# EAGLE design led board (EAGLE 9.6.2)
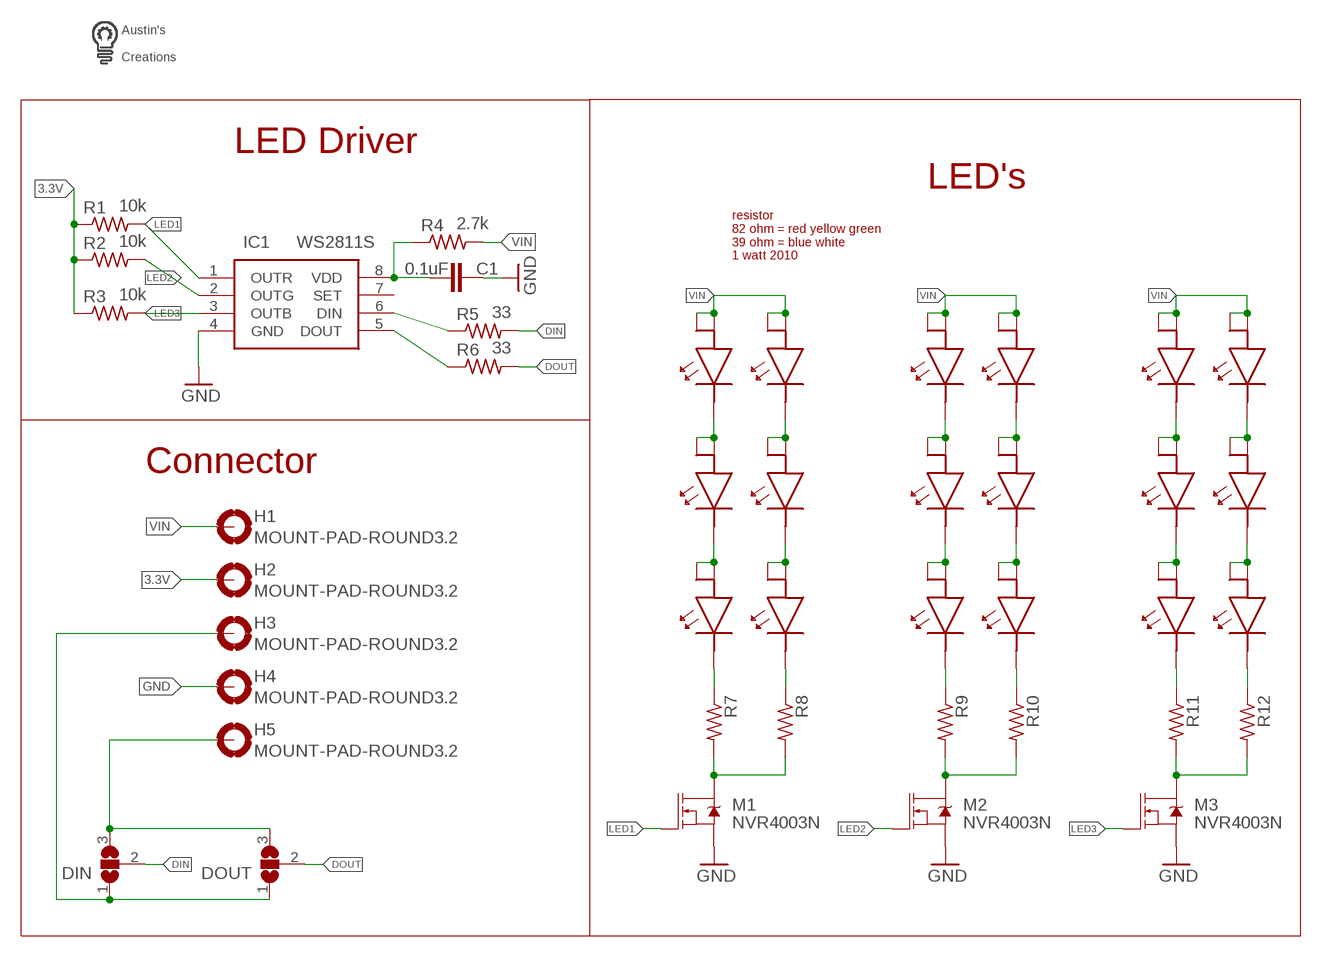
[diagram p0: schematic, sheet 1]

## Parts
C1  0.1uF  C-EUC0603K  [C0603K]
DIN  SJ2WW  [SJ_2W]
DOUT  SJ2WW  [SJ_2W]
H1  MOUNT-PAD-ROUND3.2  [3,2-PAD]
H2  MOUNT-PAD-ROUND3.2  [3,2-PAD]
H3  MOUNT-PAD-ROUND3.2  [3,2-PAD]
H4  MOUNT-PAD-ROUND3.2  [3,2-PAD]
H5  MOUNT-PAD-ROUND3.2  [3,2-PAD]
IC1  WS2811S  [SOIC127P600X175-8N]
L1  5730LED  [5730LED]
L2  5730LED  [5730LED]
L3  5730LED  [5730LED]
L4  5730LED  [5730LED]
L5  5730LED  [5730LED]
L6  5730LED  [5730LED]
L7  5730LED  [5730LED]
L8  5730LED  [5730LED]
L9  5730LED  [5730LED]
L10  5730LED  [5730LED]
L11  5730LED  [5730LED]
L12  5730LED  [5730LED]
L13  5730LED  [5730LED]
L14  5730LED  [5730LED]
L15  5730LED  [5730LED]
L16  5730LED  [5730LED]
L17  5730LED  [5730LED]
L18  5730LED  [5730LED]
M1  NVR4003N  [SOT23]
M2  NVR4003N  [SOT23]
M3  NVR4003N  [SOT23]
R1  10k  R-US_R0603  [R0603]
R2  10k  R-US_R0603  [R0603]
R3  10k  R-US_R0603  [R0603]
R4  2.7k  R-US_R0603  [R0603]
R5  33  R-US_R0603  [R0603]
R6  33  R-US_R0603  [R0603]
R7  R-US_R2010  [R2010]
R8  R-US_R2010  [R2010]
R9  R-US_R2010  [R2010]
R10  R-US_R2010  [R2010]
R11  R-US_R2010  [R2010]
R12  R-US_R2010  [R2010]
U$2  LOGO  [LOGO]

## Nets
3.3V: H2.B3,2(MOUNT) R1.1 R2.1 R3.1
DIN: DIN.2 R5.2
DOUT: DOUT.2 R6.2
GND: C1.1 H4.B3,2(MOUNT) IC1.4(GND) M1.3(S) M2.3(S) M3.3(S)
LED1: IC1.1(OUTR) M1.2(G) R1.2
LED2: IC1.2(OUTG) M2.2(G) R2.2
LED3: IC1.3(OUTB) M3.2(G) R3.2
N$1: DIN.3 DOUT.3 H5.B3,2(MOUNT)
N$2: DIN.1 DOUT.1 H3.B3,2(MOUNT)
N$3: L3.P$2 R7.1
N$4: C1.2 IC1.8(VDD) R4.1
N$5: IC1.6(DIN) R5.1
N$6: IC1.5(DOUT) R6.1
N$8: L2.P$2 L3.P$1 L3.P$3
N$9: L1.P$2 L2.P$1 L2.P$3
N$11: M1.1(D) R7.2 R8.2
N$12: L6.P$2 R8.1
N$13: L5.P$2 L6.P$1 L6.P$3
N$14: L4.P$2 L5.P$1 L5.P$3
N$16: L9.P$2 R9.1
N$17: L8.P$2 L9.P$1 L9.P$3
N$18: L7.P$2 L8.P$1 L8.P$3
N$20: M2.1(D) R9.2 R10.2
N$21: L12.P$2 R10.1
N$22: L11.P$2 L12.P$1 L12.P$3
N$23: L10.P$2 L11.P$1 L11.P$3
N$24: L15.P$2 R11.1
N$25: L14.P$2 L15.P$1 L15.P$3
N$26: L13.P$2 L14.P$1 L14.P$3
N$28: M3.1(D) R11.2 R12.2
N$29: L18.P$2 R12.1
N$30: L17.P$2 L18.P$1 L18.P$3
N$31: L16.P$2 L17.P$1 L17.P$3
VIN: H1.B3,2(MOUNT) L1.P$1 L1.P$3 L4.P$1 L4.P$3 L7.P$1 L7.P$3 L10.P$1 L10.P$3 L13.P$1 L13.P$3 L16.P$1 L16.P$3 R4.2
Unconnected: IC1.7(SET)

## Notes on the sheet
- LED Driver
- LED's
- resistor 
  82 ohm = red yellow green
  39 ohm = blue white
  1 watt 2010
- Connector

## Library data of the parts
C1 = rcl:C-EU: CAPACITOR, European symbol; SPICEPREFIX: C
DIN DOUT = jumper:SJ2W: SMD solder JUMPER
H1-H5 = holes:MOUNT-PAD-ROUND: MOUNTING PAD, round
IC1 = SamacSys_Parts:WS2811S: RGB led driver Source: Datasheet <https://cdn-shop.adafruit.com/datasheets/WS2811.pdf>; DESCRIPTION: RGB led driver; HEIGHT: 1.75mm; MANUFACTURER_NAME: Worldsemi; MANUFACTURER_PART_NUMBER: ws2811s
L1-L18 = custom parts:5730LED
M1-M3 = custom parts:NVR4003N
R1-R6 = resistor:R-US_: RESISTOR, American symbol
R7-R12 = rcl:R-US_: RESISTOR, American symbol; SPICEPREFIX: R
U$2 = custom parts:LOGO

## Board
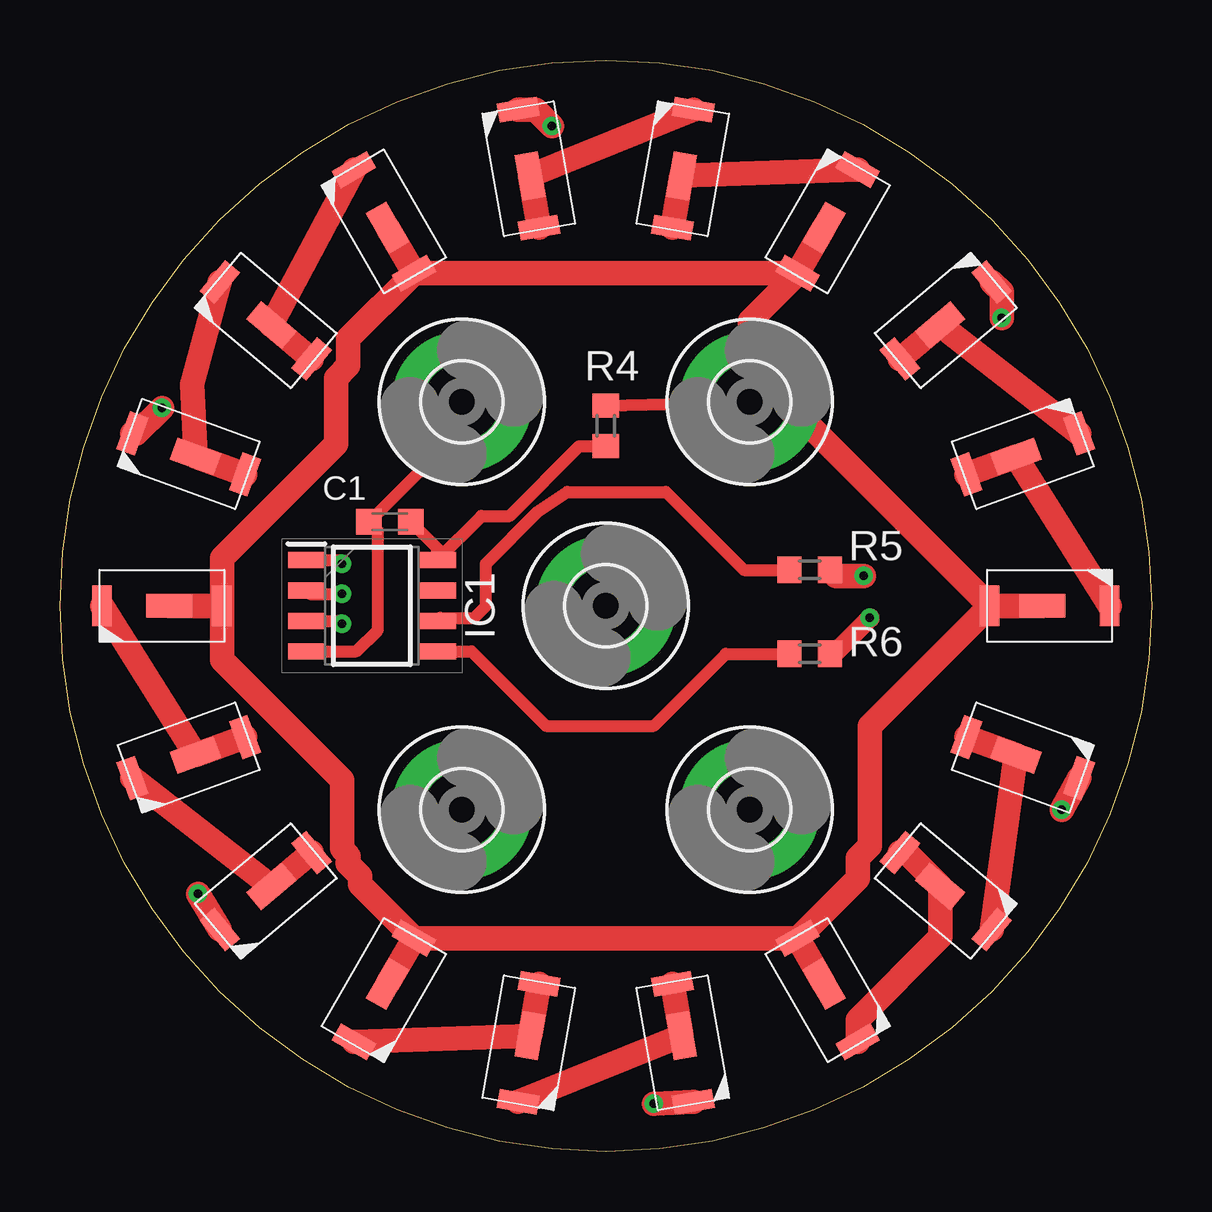
[diagram p1: board, top side]
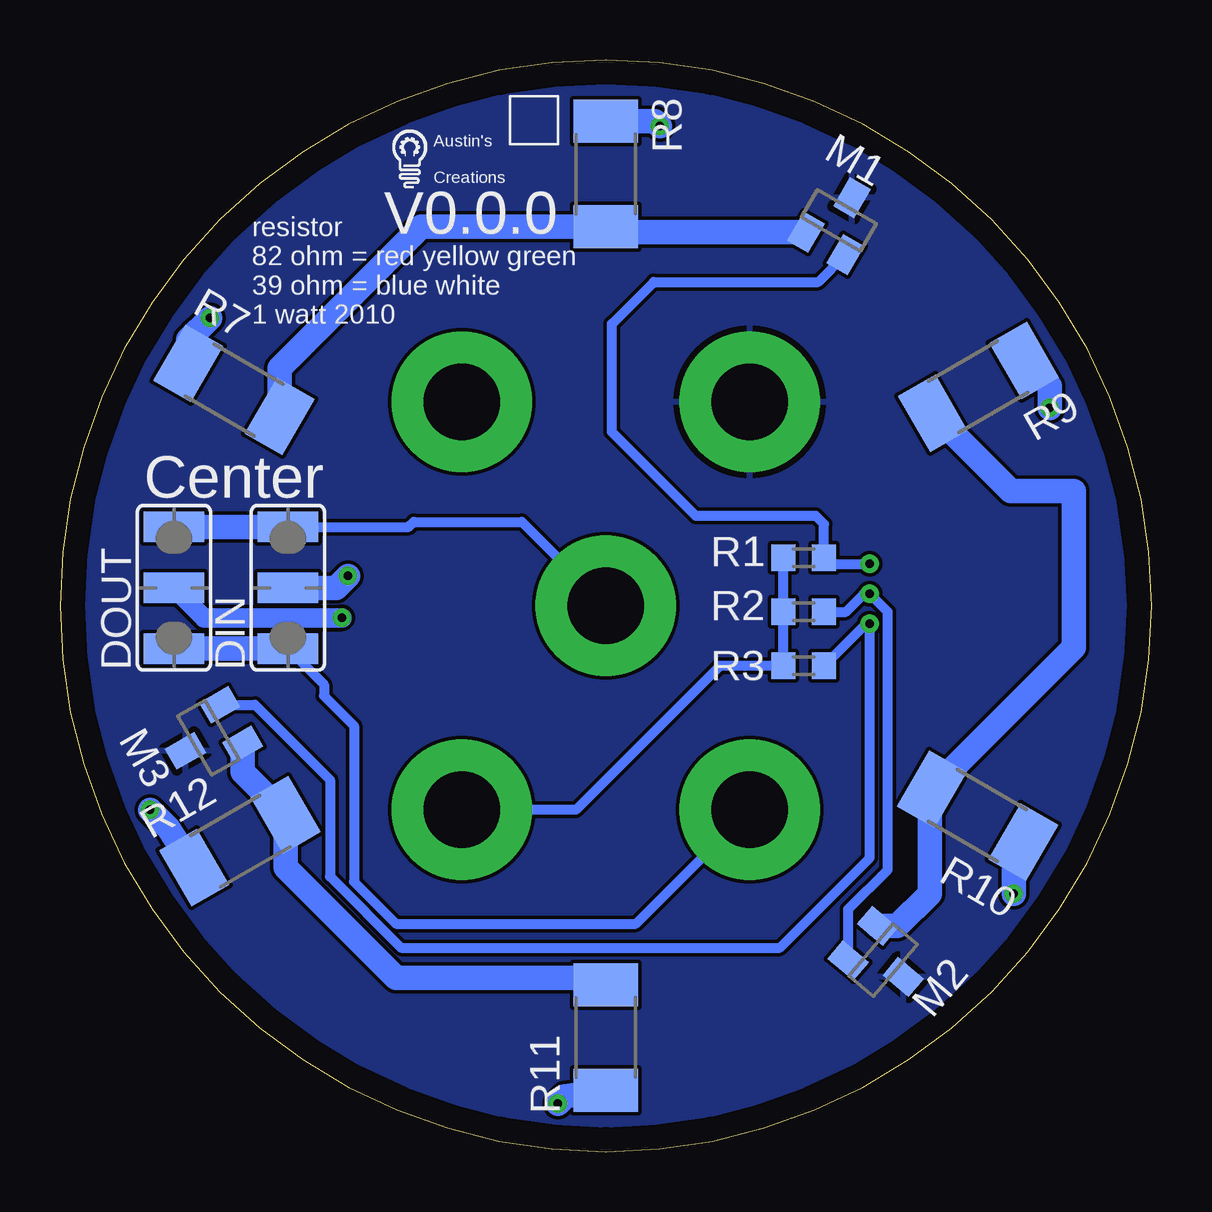
[diagram p2: board, bottom side, seen from below]

Size 45.5 x 45.5 mm. Coordinates in mm from the lower left corner, seen from the top.
Outline: 22.75,0 arc-180 22.75,45.5 arc-180 22.75,0
Copper layers (1*16): Top 0.035mm / dielectric 1.5mm / Bottom 0.035mm
Design rules "default *": minimum track width 10mil, minimum drill 0.35mm, track to track 6mil, track to pad 6mil, pad to pad 6mil, via to via 6mil, smd to smd 6mil, copper to edge 40mil, drill to drill 6mil, minimum pad ring 10mil, minimum via ring 8mil, stop-mask expansion 4mil, vias tented up to drill 0mil, thermal gap 10mil

### Footprints (pad centres in the part's own frame; a part is rotated, then mirrored left to right if it is on the bottom)
C0603K = smd 1.05 x 1.08: 1 -0.875,0; 2 0.875,0
SJ_2W = smd 1.27 x 2.54: 1 -2.54,0; 2 0,0; 3 2.54,0
3,2-PAD = drill 3.2 pad 5.842: B3,2 0,0
SOIC127P600X175-8N = smd 1.55 x 0.65: 1 -2.725,1.905; 2 -2.725,0.635; 3 -2.725,-0.635; 4 -2.725,-1.905; 5 2.725,-1.905; 6 2.725,-0.635; 7 2.725,0.635; 8 2.725,1.905
5730LED = smd 0.813 x 1.676: P$1 -2.5,0; P$2 2.5,0 | smd 1.93 x 0.965: P$3 -0.3,0
SOT23 = smd 1 x 1.4: 1 -0.95,-1.1; 2 0.95,-1.1; 3 0,1.1
R0603 = smd 1 x 1.1: 1 -0.85,0; 2 0.85,0
R2010 = smd 1.8 x 2.7: 1 -2.2,0; 2 2.2,0

### Placement (x,y rotation side)
C1  13.75,26.25 0 top
DIN  36,23.5 90 bottom
DOUT  40.75,23.5 90 bottom
H1  28.75,31.25 0 top
H2  28.75,14.25 0 top
H3  16.75,14.25 0 top
H4  16.75,31.25 0 top
H5  22.75,22.75 0 top
IC1  13,22.75 0 top
L1  41.25,22.75 0 top
L2  40.13,29.08 20 top
L3  36.92,34.64 40 top
L4  32,38.77 60 top
L5  25.96,40.97 80 top
L6  19.54,40.97 100 top
L7  13.5,38.77 120 top
L8  8.58,34.64 140 top
L9  5.37,29.08 160 top
L10  4.25,22.75 180 top
L11  5.37,16.42 200 top
L12  8.58,10.86 220 top
L13  13.5,6.73 240 top
L14  19.54,4.53 260 top
L15  25.96,4.53 280 top
L16  32,6.73 300 top
L17  36.92,10.86 320 top
L18  40.13,16.42 340 top
M1  13.03,38.81 330 bottom
M2  11.19,7.98 230 bottom
M3  39.32,17.25 120 bottom
R1  14.5,24.75 0 bottom
R2  14.5,22.5 0 bottom
R3  14.5,20.25 0 bottom
R4  22.75,30.25 90 top
R5  31.25,24.25 0 top
R6  31.25,20.75 0 top
R7  38.25,31.75 330 bottom
R8  22.75,40.75 270 bottom
R9  7.22,31.88 210 bottom
R10  7.25,14 150 bottom
R11  22.75,4.75 90 bottom
R12  38,12.93 30 bottom
U$2  31.64,40.16 0 bottom

### Tracks (layer width: path | path; a pad name or v marks a point on that pad's centre or on a via)
3.3V
  Bottom 0.406: R1.1 R2.1 R3.1 18,20.25 24,14.25 H2.B3,2
DIN  (via drill 0.35)
  Top 1.016: v33.5,24 32.35,24 R5.2
  Bottom 1.016: DIN.2 34,23.5 v33.5,24
DOUT  (via drill 0.35)
  Top 0.813: v33.75,22.25 32.25,20.75 R6.2
  Bottom 0.813: DOUT.2 39.5,22.25 v33.75,22.25
GND
  Top 0.508: H4.B3,2 16.75,30.12 C1.1 13.25,25.88 13.25,21.75 12.35,20.84 IC1.4
  pour Bottom: 22.75,45.5 arc90 0,22.75 arc90 22.75,0 arc90 45.5,22.75 arc90
LED1  (via drill 0.35)
  Top 0.508: IC1.1 11.6,24.66 v11.75,24.5
  Bottom 0.406: M1.2 13.89,36.25 20.75,36.25 22.5,34.5 22.5,30 19,26.5 14,26.5 13.65,26.15 R1.2 13.4,24.5 v11.75,24.5
LED2  (via drill 0.35)
  Top 0.508: IC1.2 10.41,23.25 v11.75,23.25
  Bottom 0.406: M2.2 12.64,9.56 12.65,9.6 12.64,9.6 12.64,10.11 11,11.75 11,20 11,20.25 11,22.5 v11.75,23.25 12,23.25 12.75,22.5 R2.2
LED3  (via drill 0.35)
  Top 0.508: IC1.3 11.63,22.11 v11.75,22
  Bottom 0.406: M3.2 37.37,18.62 34.25,15.5 34.25,11.46 31.29,8.5 15.5,8.5 11.75,12.25 v11.75,22 11.9,22 R3.2
N$1
  Bottom 0.406: DIN.3 30.96,26.04 30.75,26.25 26.25,26.25 H5.B3,2
  Bottom 1.016: DOUT.3 DIN.3
N$2
  Bottom 0.406: DIN.1 34.5,19.46 34.5,19 33.25,17.75 33.25,11.25 31.5,9.5 21.5,9.5 H3.B3,2
  Bottom 1.016: DOUT.1 DIN.1
N$3  (via drill 0.35)
  Top 1.016: L3.P$2 39.25,35.84 v39.25,34.75
  Bottom 1.016: v39.25,34.75 40.16,33.84 R7.1
N$4
  Top 0.508: R4.1 21.65,29.4 18.75,26.5 17.57,26.5 IC1.8 15.72,25.15 C1.2
N$5
  Top 0.508: IC1.6 15.86,22.25 17.25,22.25 17.75,22.75 17.75,24.5 19.92,26.67 21.14,27.5 25.25,27.5 28.5,24.25 R5.1
N$6
  Top 0.508: IC1.5 17.16,20.84 20.25,17.75 24.75,17.75 27.75,20.75 R6.1
N$8
  Top 1.016: L3.P$1 L3.P$3 L2.P$2
N$9
  Top 1.016: L2.P$1 L2.P$3 L1.P$2
N$11
  Bottom 1.016: M1.1 22.53,38.33 R8.2 30.45,38.55 36.34,32.66 R7.2
N$12  (via drill 0.35)
  Top 1.016: L6.P$2 19.82,43.43 v20.5,42.75
  Bottom 1.016: v20.5,42.75 20.7,42.95 R8.1
N$13
  Top 1.016: L6.P$1 L6.P$3 L5.P$2
N$14
  Top 1.016: L5.P$1 L5.P$3 L4.P$2
N$16  (via drill 0.35)
  Top 1.016: v4.25,31 3.18,29.93 L9.P$2
  Bottom 1.016: v4.25,31 4.25,31.91 R9.1
N$17
  Top 1.016: L8.P$2 5.5,32 L9.P$3 L9.P$1
N$18
  Top 1.016: L8.P$1 L8.P$3 L7.P$2
N$20
  Bottom 1.016: R9.2 5.87,27.52 3.25,27.52 3.25,21 R10.2 9.25,15 9.25,10.75 10.59,9.41 M2.1
N$21  (via drill 0.35)
  Top 1.016: L12.P$2 v5.75,10.75
  Bottom 1.016: v5.75,10.75 5.75,11.72 R10.1
N$22
  Top 1.016: L12.P$1 L12.P$3 L11.P$2
N$23
  Top 1.016: L11.P$1 L11.P$3 L10.P$2
N$24  (via drill 0.35)
  Top 1.016: L15.P$2 v24.75,2
  Bottom 1.016: v24.75,2 24.46,2.29 R11.1
N$25
  Top 1.016: L15.P$1 L15.P$3 L14.P$2
N$26
  Top 1.016: L14.P$1 L14.P$3 L13.P$2
N$28
  Bottom 1.016: R11.2 23.05,7.25 31.5,7.25 36.09,11.85 R12.2 37.89,15.83 M3.1
N$29  (via drill 0.35)
  Top 1.016: L18.P$2 v41.75,14.25
  Bottom 1.016: v41.75,14.25 41,13.5 R12.1
N$30
  Top 1.016: L18.P$1 L18.P$3 L17.P$2
N$31
  Top 1.016: L16.P$2 33.25,5.5 36.69,8.94 L17.P$3 35.28,12.46 L17.P$1
VIN
  Top 0.508: R4.2 H1.B3,2
  Top 1.016: L7.P$3 L7.P$1 | L4.P$3 30.94,36.93 | 30.94,36.93 L4.P$1 28.75,34.61 H1.B3,2 30.25,31.25 L1.P$1 | L1.P$1 L1.P$3 | L16.P$1 L16.P$3 | L13.P$3 L13.P$1 | L10.P$3 L10.P$1 | L7.P$1 30.61,36.61 30.94,36.93 | L16.P$1 33.25,11.39 33.25,12.25 33.75,12.75 33.75,17.75 L1.P$1 | L16.P$1 L13.P$1 | L13.P$1 12.5,11.14 12.5,11.5 12,12 12.03,12.3 11.75,12.63 11.75,15.5 6.75,20.5 L10.P$1 | L7.P$1 12.02,33.88 12.02,32.77 11.5,32.25 11.5,29.5 6.75,24.75 L10.P$1

### Text on the board
bPlace: V0.0.0 | resistor / 82 ohm = red yellow green / 39 ohm = blue white / 1 watt 2010 | Center